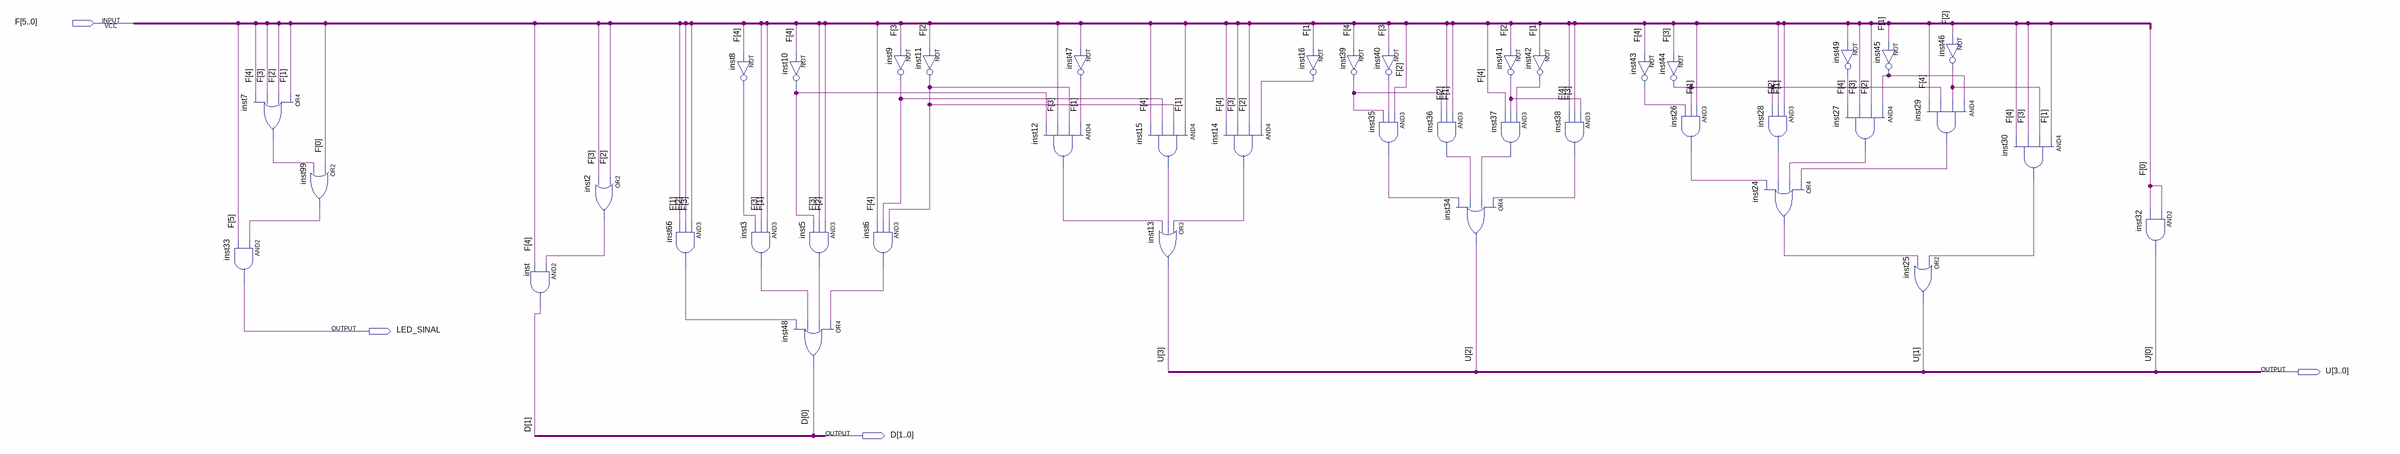
[diagram p0: schematic sheet]
// Quartus schematic BIN_DC6bits.bdf as structural Verilog: 42 symbols, 4 pins
module BIN_DC6bits (
  input  [5:0] F,
  output LED_SINAL,
  output [3:0] U,
  output [1:0] D
);

  wire inst2_out, inst3_out, inst5_out, inst6_out, inst7_out, inst8_out, inst9_out, inst10_out, inst11_out,
       inst12_out, inst14_out, inst15_out, inst16_out, inst24_out, inst26_out, inst27_out, inst28_out,
       inst29_out, inst30_out, inst35_out, inst36_out, inst37_out, inst38_out, inst39_out, inst40_out,
       inst41_out, inst42_out, inst43_out, inst44_out, inst45_out, inst46_out, inst47_out, inst49_out,
       inst66_out, inst99_out;

  or inst7 (inst7_out, F[1], F[2], F[3], F[4]);
  and inst33 (LED_SINAL, inst99_out, F[5]);
  or inst99 (inst99_out, F[0], inst7_out);
  and inst (D[1], inst2_out, F[4]);
  or inst2 (inst2_out, F[2], F[3]);
  and inst66 (inst66_out, F[3], F[2], F[1]);
  not inst8 (inst8_out, F[4]);
  and inst3 (inst3_out, F[1], F[3], inst8_out);
  not inst10 (inst10_out, F[4]);
  and inst5 (inst5_out, F[2], F[3], inst10_out);
  or inst48 (D[0], inst6_out, inst5_out, inst3_out, inst66_out);
  and inst6 (inst6_out, inst11_out, inst9_out, F[4]);
  not inst9 (inst9_out, F[3]);
  not inst11 (inst11_out, F[2]);
  and inst12 (inst12_out, inst47_out, inst11_out, F[3], inst10_out);
  not inst47 (inst47_out, F[1]);
  and inst15 (inst15_out, F[1], inst11_out, inst9_out, F[4]);
  or inst13 (U[3], inst14_out, inst15_out, inst12_out);
  and inst14 (inst14_out, inst16_out, F[2], F[3], F[4]);
  not inst16 (inst16_out, F[1]);
  not inst39 (inst39_out, F[4]);
  not inst40 (inst40_out, F[3]);
  and inst35 (inst35_out, F[2], inst40_out, inst39_out);
  and inst36 (inst36_out, F[1], F[2], inst39_out);
  or inst34 (U[2], inst38_out, inst37_out, inst36_out, inst35_out);
  not inst41 (inst41_out, F[2]);
  and inst37 (inst37_out, inst42_out, inst41_out, F[4]);
  not inst42 (inst42_out, F[1]);
  and inst38 (inst38_out, inst41_out, F[3], F[4]);
  not inst43 (inst43_out, F[4]);
  not inst44 (inst44_out, F[3]);
  and inst26 (inst26_out, F[1], inst44_out, inst43_out);
  or inst24 (inst24_out, inst29_out, inst27_out, inst28_out, inst26_out);
  and inst28 (inst28_out, F[1], F[2], inst44_out);
  not inst49 (inst49_out, F[4]);
  and inst27 (inst27_out, inst45_out, F[2], F[3], inst49_out);
  not inst45 (inst45_out, F[1]);
  not inst46 (inst46_out, F[2]);
  and inst29 (inst29_out, inst45_out, inst46_out, inst44_out, F[4]);
  or inst25 (U[1], inst30_out, inst24_out);
  and inst30 (inst30_out, F[1], inst46_out, F[3], F[4]);
  and inst32 (U[0], F[0], F[0]);
endmodule
